# Altium schematic sheet 05-USB_ETHERNET.SchDoc
size A4
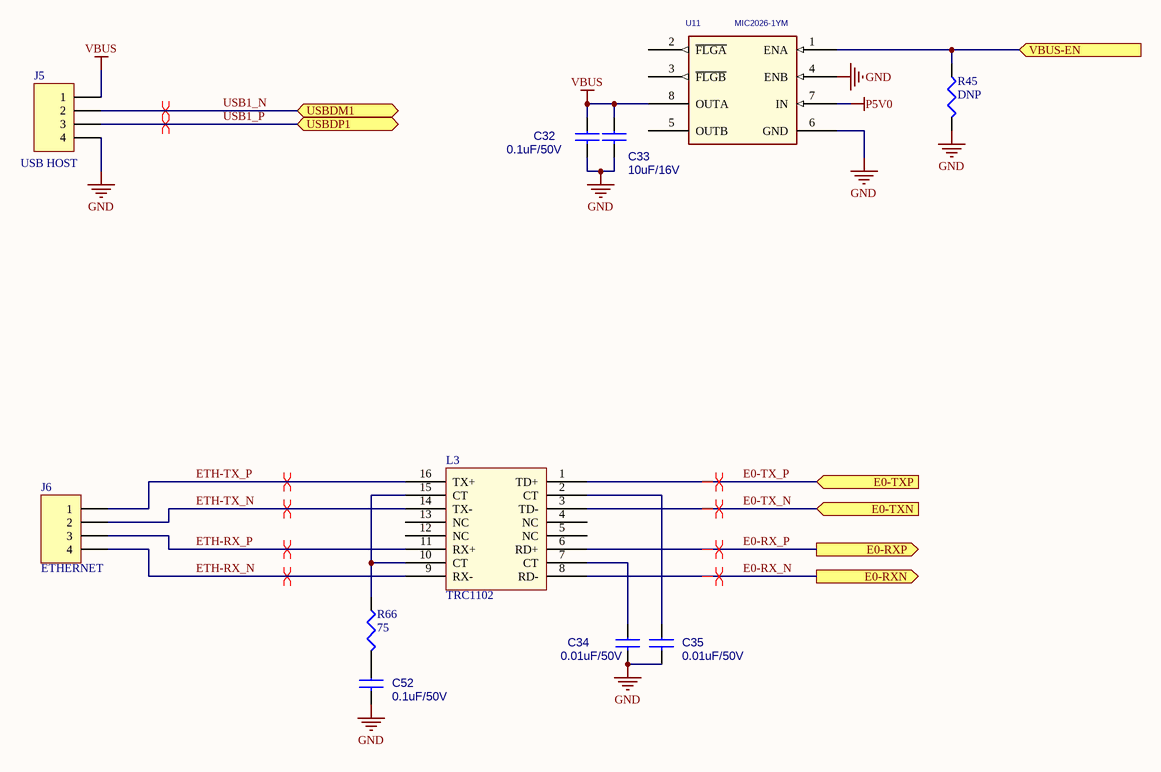
[diagram p0: 05-USB_ETHERNET.SchDoc]

## Parts
C32  0.1uF/50V  [0402]
C33  10uF/16V  [0805]
C34  0.01uF/50V  [0402]
C35  0.01uF/50V  [0402]
C52  0.1uF/50V  [0402]
J5  USB HOST  [CONN-2.0-SMD-4P-V]
J6  ETHERNET  [CONN-2.0-SMD-4P-V]
L3  TRC1102  [TRC1102]
R45  DNP  [0402]
R66  75  [0402]
U11  MIC2026-1YM  [SO8]

## Ports
E0-RXN (out), E0-RXP (out), E0-TXN (in), E0-TXP (in), USBDM1, USBDP1, VBUS-EN (in)

## Nets
GND: C32.2 C33.2 C34.2 C35.2 C52.2 J5.4 R45.1 U11.4(ENB) U11.6(GND)
P5V0: U11.7(IN)
VBUS: C32.1 C33.1 J5.1 U11.8(OUTA)
E0-RX_N: L3.8(RD-) ; port E0-RXN
E0-RX_P: L3.6(RD+) ; port E0-RXP
E0-TX_N: L3.3(TD-) ; port E0-TXN
E0-TX_P: L3.1(TD+) ; port E0-TXP
ETH-RX_N: J6.4 L3.9(RX-)
ETH-RX_P: J6.3 L3.11(RX+)
ETH-TX_N: J6.2 L3.14(TX-)
ETH-TX_P: J6.1 L3.16(TX+)
USB1_N: J5.2 ; port USBDM1
USB1_P: J5.3 ; port USBDP1
VBUS-EN: R45.2 U11.1(ENA) ; port VBUS-EN
NetC34_1: C34.1 L3.7(CT)
NetC35_1: C35.1 L3.2(CT)
NetC52_1: C52.1 R66.1
NetL3_10: L3.10(CT) L3.15(CT) R66.2

Not connected (* = marked no-connect by the designer): L3 4(NC) 5(NC) 12(NC) 13(NC); U11 2(~{FLGA}) 3(~{FLGB}) 5(OUTB)

## Layout directives
differential pair: E0-RX_N, E0-RX_P, E0-TX_N, E0-TX_P, ETH-RX_N, ETH-RX_P, ETH-TX_N, ETH-TX_P, USB1_N, USB1_P

## Library data of the parts
C32-C35 C52 = CAP_Dup1
J5 J6 = Header 4: Header, 4-Pin; LatestRevisionDate: 17-Jul-2002; LatestRevisionNote: Re-released for DXP Platform.; Publisher: Altium Limited
R45 R66 = CR16-1003FM
U11 = MIC2526_8P: IC LIN SW PWR ACTIVE HIGH DUAL 2.7V-5.5V 0.5A SOIC8; CAD_APPROVED: Yes; MFG_NAME01: MICREL; AGILE_PN: 312-75936; CLASS: IC; HEIGHT: 1.73mm; ROHS: Yes; MFG_PN01: MIC2026-1YM